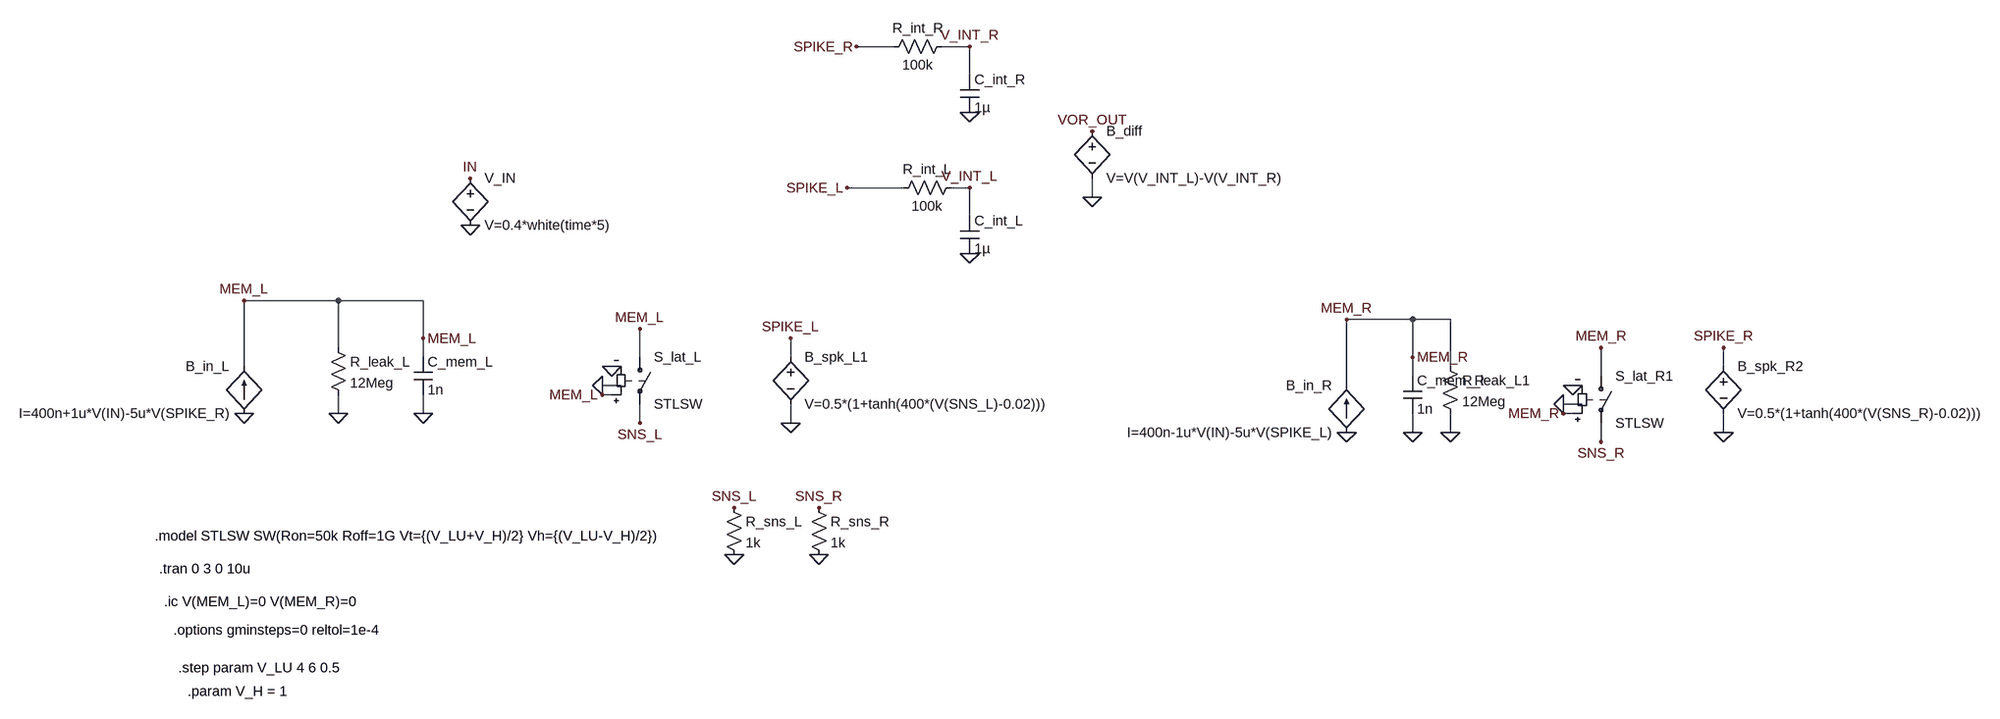
[diagram p0: schematic circuit_ver2.asc]
circuit_ver2.asc, the LTspice schematic file:
Version 4.1
SHEET 1 4196 1800
WIRE 1728 464 1664 464
WIRE 1856 464 1808 464
WIRE 1856 512 1856 464
WIRE 1744 704 1648 704
WIRE 1856 704 1824 704
WIRE 2064 720 2064 688
WIRE 1856 752 1856 704
WIRE 784 896 624 896
WIRE 928 896 784 896
WIRE 2608 928 2496 928
WIRE 2672 928 2608 928
WIRE 928 960 928 896
WIRE 784 976 784 896
WIRE 928 992 928 960
WIRE 1296 992 1296 944
WIRE 1552 992 1552 960
WIRE 2608 992 2608 928
WIRE 624 1008 624 896
WIRE 1264 1008 1248 1008
WIRE 2672 1008 2672 928
WIRE 3136 1008 3136 976
WIRE 2608 1024 2608 992
WIRE 2928 1024 2928 976
WIRE 1264 1040 1232 1040
WIRE 2496 1040 2496 928
WIRE 2896 1040 2880 1040
WIRE 1248 1056 1232 1056
WIRE 2896 1072 2864 1072
WIRE 784 1088 784 1056
WIRE 928 1088 928 1056
WIRE 2880 1088 2864 1088
WIRE 1296 1104 1296 1072
WIRE 1552 1104 1552 1072
WIRE 2608 1120 2608 1088
WIRE 2672 1120 2672 1088
WIRE 3136 1120 3136 1088
WIRE 2928 1136 2928 1104
FLAG 928 960 MEM_L
FLAG 928 1088 0
FLAG 1296 944 MEM_L
FLAG 1232 1056 MEM_L
FLAG 1232 1040 0
FLAG 1552 960 SPIKE_L
FLAG 1552 1104 0
FLAG 1248 1008 0
FLAG 2608 992 MEM_R
FLAG 2608 1120 0
FLAG 3136 976 SPIKE_R
FLAG 3136 1120 0
FLAG 1648 704 SPIKE_L
FLAG 1664 464 SPIKE_R
FLAG 1856 704 V_INT_L
FLAG 1856 464 V_INT_R
FLAG 2064 720 0
FLAG 2064 608 VOR_OUT
FLAG 1856 576 0
FLAG 1856 816 0
FLAG 624 1088 0
FLAG 624 896 MEM_L
FLAG 2496 1120 0
FLAG 1456 1248 SNS_L
FLAG 1600 1248 SNS_R
FLAG 1456 1328 0
FLAG 1600 1328 0
FLAG 2496 928 MEM_R
FLAG 1296 1104 SNS_L
FLAG 2928 976 MEM_R
FLAG 2864 1088 MEM_R
FLAG 2864 1072 0
FLAG 2880 1040 0
FLAG 2928 1136 SNS_R
FLAG 784 1088 0
FLAG 2672 1120 0
FLAG 1008 688 IN
FLAG 1008 768 0
SYMBOL cap 912 992 R0
SYMATTR InstName C_mem_L
SYMATTR Value 1n
SYMBOL sw 1296 976 R0
SYMATTR InstName S_lat_L
SYMATTR Value STLSW
SYMBOL bv 1552 976 R0
SYMATTR InstName B_spk_L1
SYMATTR Value V=0.5*(1+tanh(400*(V(SNS_L)-0.02)))
SYMBOL cap 2592 1024 R0
SYMATTR InstName C_mem_R
SYMATTR Value 1n
SYMBOL bv 3136 992 R0
SYMATTR InstName B_spk_R2
SYMATTR Value V=0.5*(1+tanh(400*(V(SNS_R)-0.02)))
SYMBOL res 1840 688 R90
WINDOW 0 0 56 VBottom 2
WINDOW 3 32 56 VTop 2
SYMATTR InstName R_int_L
SYMATTR Value 100k
SYMBOL res 1824 448 R90
WINDOW 0 0 56 VBottom 2
WINDOW 3 32 56 VTop 2
SYMATTR InstName R_int_R
SYMATTR Value 100k
SYMBOL cap 1840 752 R0
SYMATTR InstName C_int_L
SYMATTR Value 1µ
SYMBOL cap 1840 512 R0
SYMATTR InstName C_int_R
SYMATTR Value 1µ
SYMBOL bv 2064 592 R0
SYMATTR InstName B_diff
SYMATTR Value V=V(V_INT_L)-V(V_INT_R)
SYMBOL bi 624 1088 R180
WINDOW 0 24 80 Left 2
WINDOW 3 24 0 Left 2
SYMATTR InstName B_in_L
SYMATTR Value I=400n+1u*V(IN)-5u*V(SPIKE_R)
SYMBOL bi 2496 1120 R180
WINDOW 0 24 80 Left 2
WINDOW 3 24 0 Left 2
SYMATTR InstName B_in_R
SYMATTR Value I=400n-1u*V(IN)-5u*V(SPIKE_L)
SYMBOL res 1440 1232 R0
SYMATTR InstName R_sns_L
SYMATTR Value 1k
SYMBOL res 1584 1232 R0
SYMATTR InstName R_sns_R
SYMATTR Value 1k
SYMBOL sw 2928 1008 R0
SYMATTR InstName S_lat_R1
SYMATTR Value STLSW
SYMBOL res 768 960 R0
SYMATTR InstName R_leak_L
SYMATTR Value 12Meg
SYMBOL res 2656 992 R0
SYMATTR InstName R_leak_L1
SYMATTR Value 12Meg
SYMBOL bv 1008 672 R0
SYMATTR InstName V_IN
SYMATTR Value V=0.4*white(time*5)
TEXT 472 1296 Left 2 !.model STLSW SW(Ron=50k Roff=1G Vt={(V_LU+V_H)/2} Vh={(V_LU-V_H)/2})
TEXT 480 1352 Left 2 !.tran 0 3 0 10u
TEXT 488 1408 Left 2 !.ic V(MEM_L)=0 V(MEM_R)=0
TEXT 504 1456 Left 2 !.options gminsteps=0 reltol=1e-4
TEXT 512 1520 Left 2 !.step param V_LU 4 6 0.5
TEXT 528 1560 Left 2 !.param V_H = 1

The netlist it stands for:
* circuit_ver2.asc
C_mem_L MEM_L 0 1n
S_lat_L MEM_L SNS_L MEM_L 0 STLSW
B_spk_L1 SPIKE_L 0 V=0.5*(1+tanh(400*(V(SNS_L)-0.02)))
C_mem_R MEM_R 0 1n
B_spk_R2 SPIKE_R 0 V=0.5*(1+tanh(400*(V(SNS_R)-0.02)))
R_int_L V_INT_L SPIKE_L 100k
R_int_R V_INT_R SPIKE_R 100k
C_int_L V_INT_L 0 1µ
C_int_R V_INT_R 0 1µ
B_diff VOR_OUT 0 V=V(V_INT_L)-V(V_INT_R)
B_in_L 0 MEM_L I=400n+1u*V(IN)-5u*V(SPIKE_R)
B_in_R 0 MEM_R I=400n-1u*V(IN)-5u*V(SPIKE_L)
R_sns_L SNS_L 0 1k
R_sns_R SNS_R 0 1k
S_lat_R1 MEM_R SNS_R MEM_R 0 STLSW
R_leak_L MEM_L 0 12Meg
R_leak_L1 MEM_R 0 12Meg
B§V_IN IN 0 V=0.4*white(time*5)
.model STLSW SW(Ron=50k Roff=1G Vt={(V_LU+V_H)/2} Vh={(V_LU-V_H)/2})
.tran 0 3 0 10u
.ic V(MEM_L)=0 V(MEM_R)=0
.options gminsteps=0 reltol=1e-4
.step param V_LU 4 6 0.5
.param V_H = 1
.backanno
.end